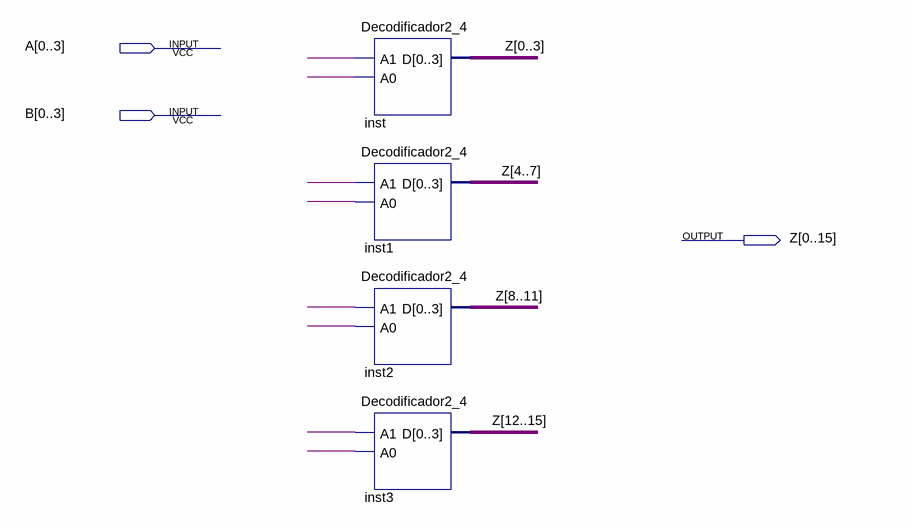
[diagram p0: schematic sheet]
// Quartus schematic Decodificador4_16.bdf as structural Verilog: 4 symbols, 3 pins
module Decodificador4_16 (
  input  [0:3] A,
  input  [0:3] B,
  output [0:15] Z
);

  wire undriven, undriven_2, undriven_3, undriven_4, undriven_5, undriven_6, undriven_7, undriven_8;

  Decodificador2_4 inst (.A1(undriven_8), .A0(undriven_7), .D(Z[0:3]));
  Decodificador2_4 inst1 (.A1(undriven_5), .A0(undriven_6), .D(Z[4:7]));
  Decodificador2_4 inst2 (.A1(undriven), .A0(undriven_2), .D(Z[8:11]));
  Decodificador2_4 inst3 (.A1(undriven_3), .A0(undriven_4), .D(Z[12:15]));
endmodule
